# Altium schematic sheet FC-Sch.schdoc
size 576 x 369 mm
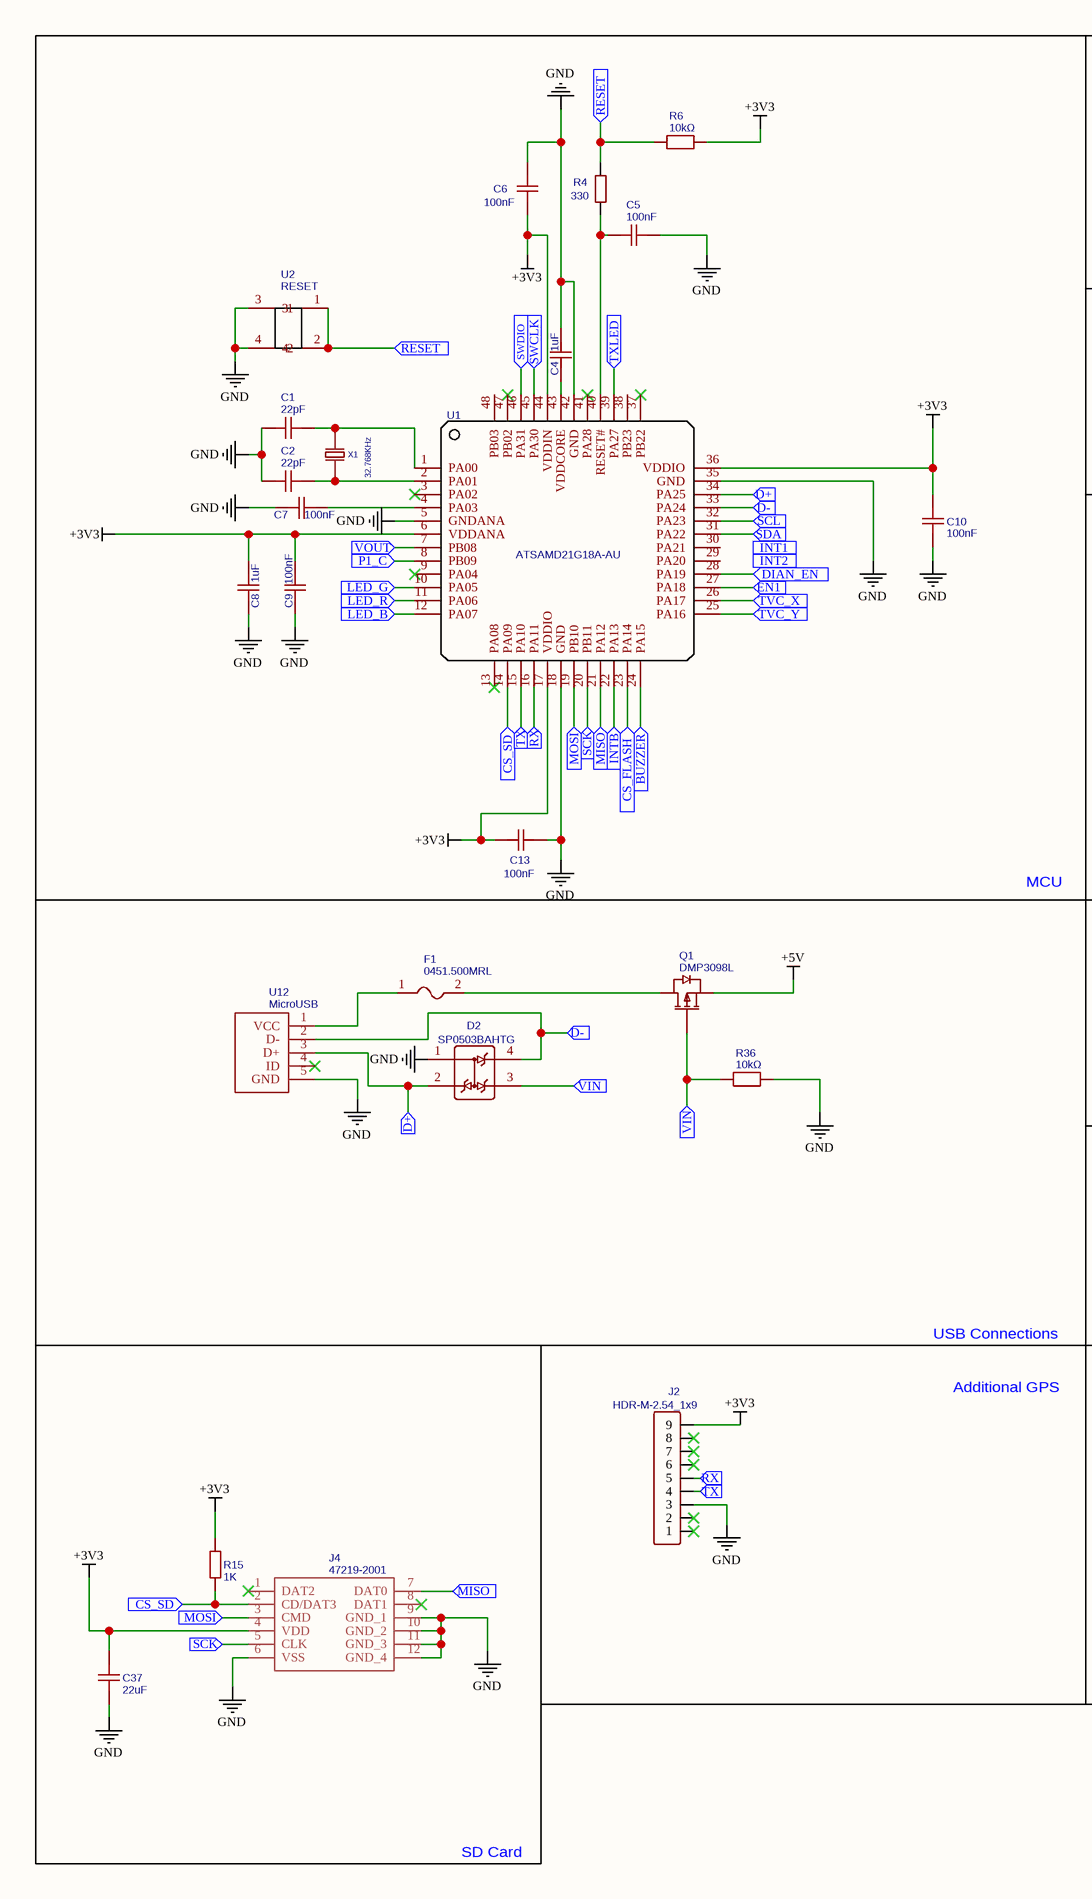
[diagram p0: FC-Sch.schdoc, left]
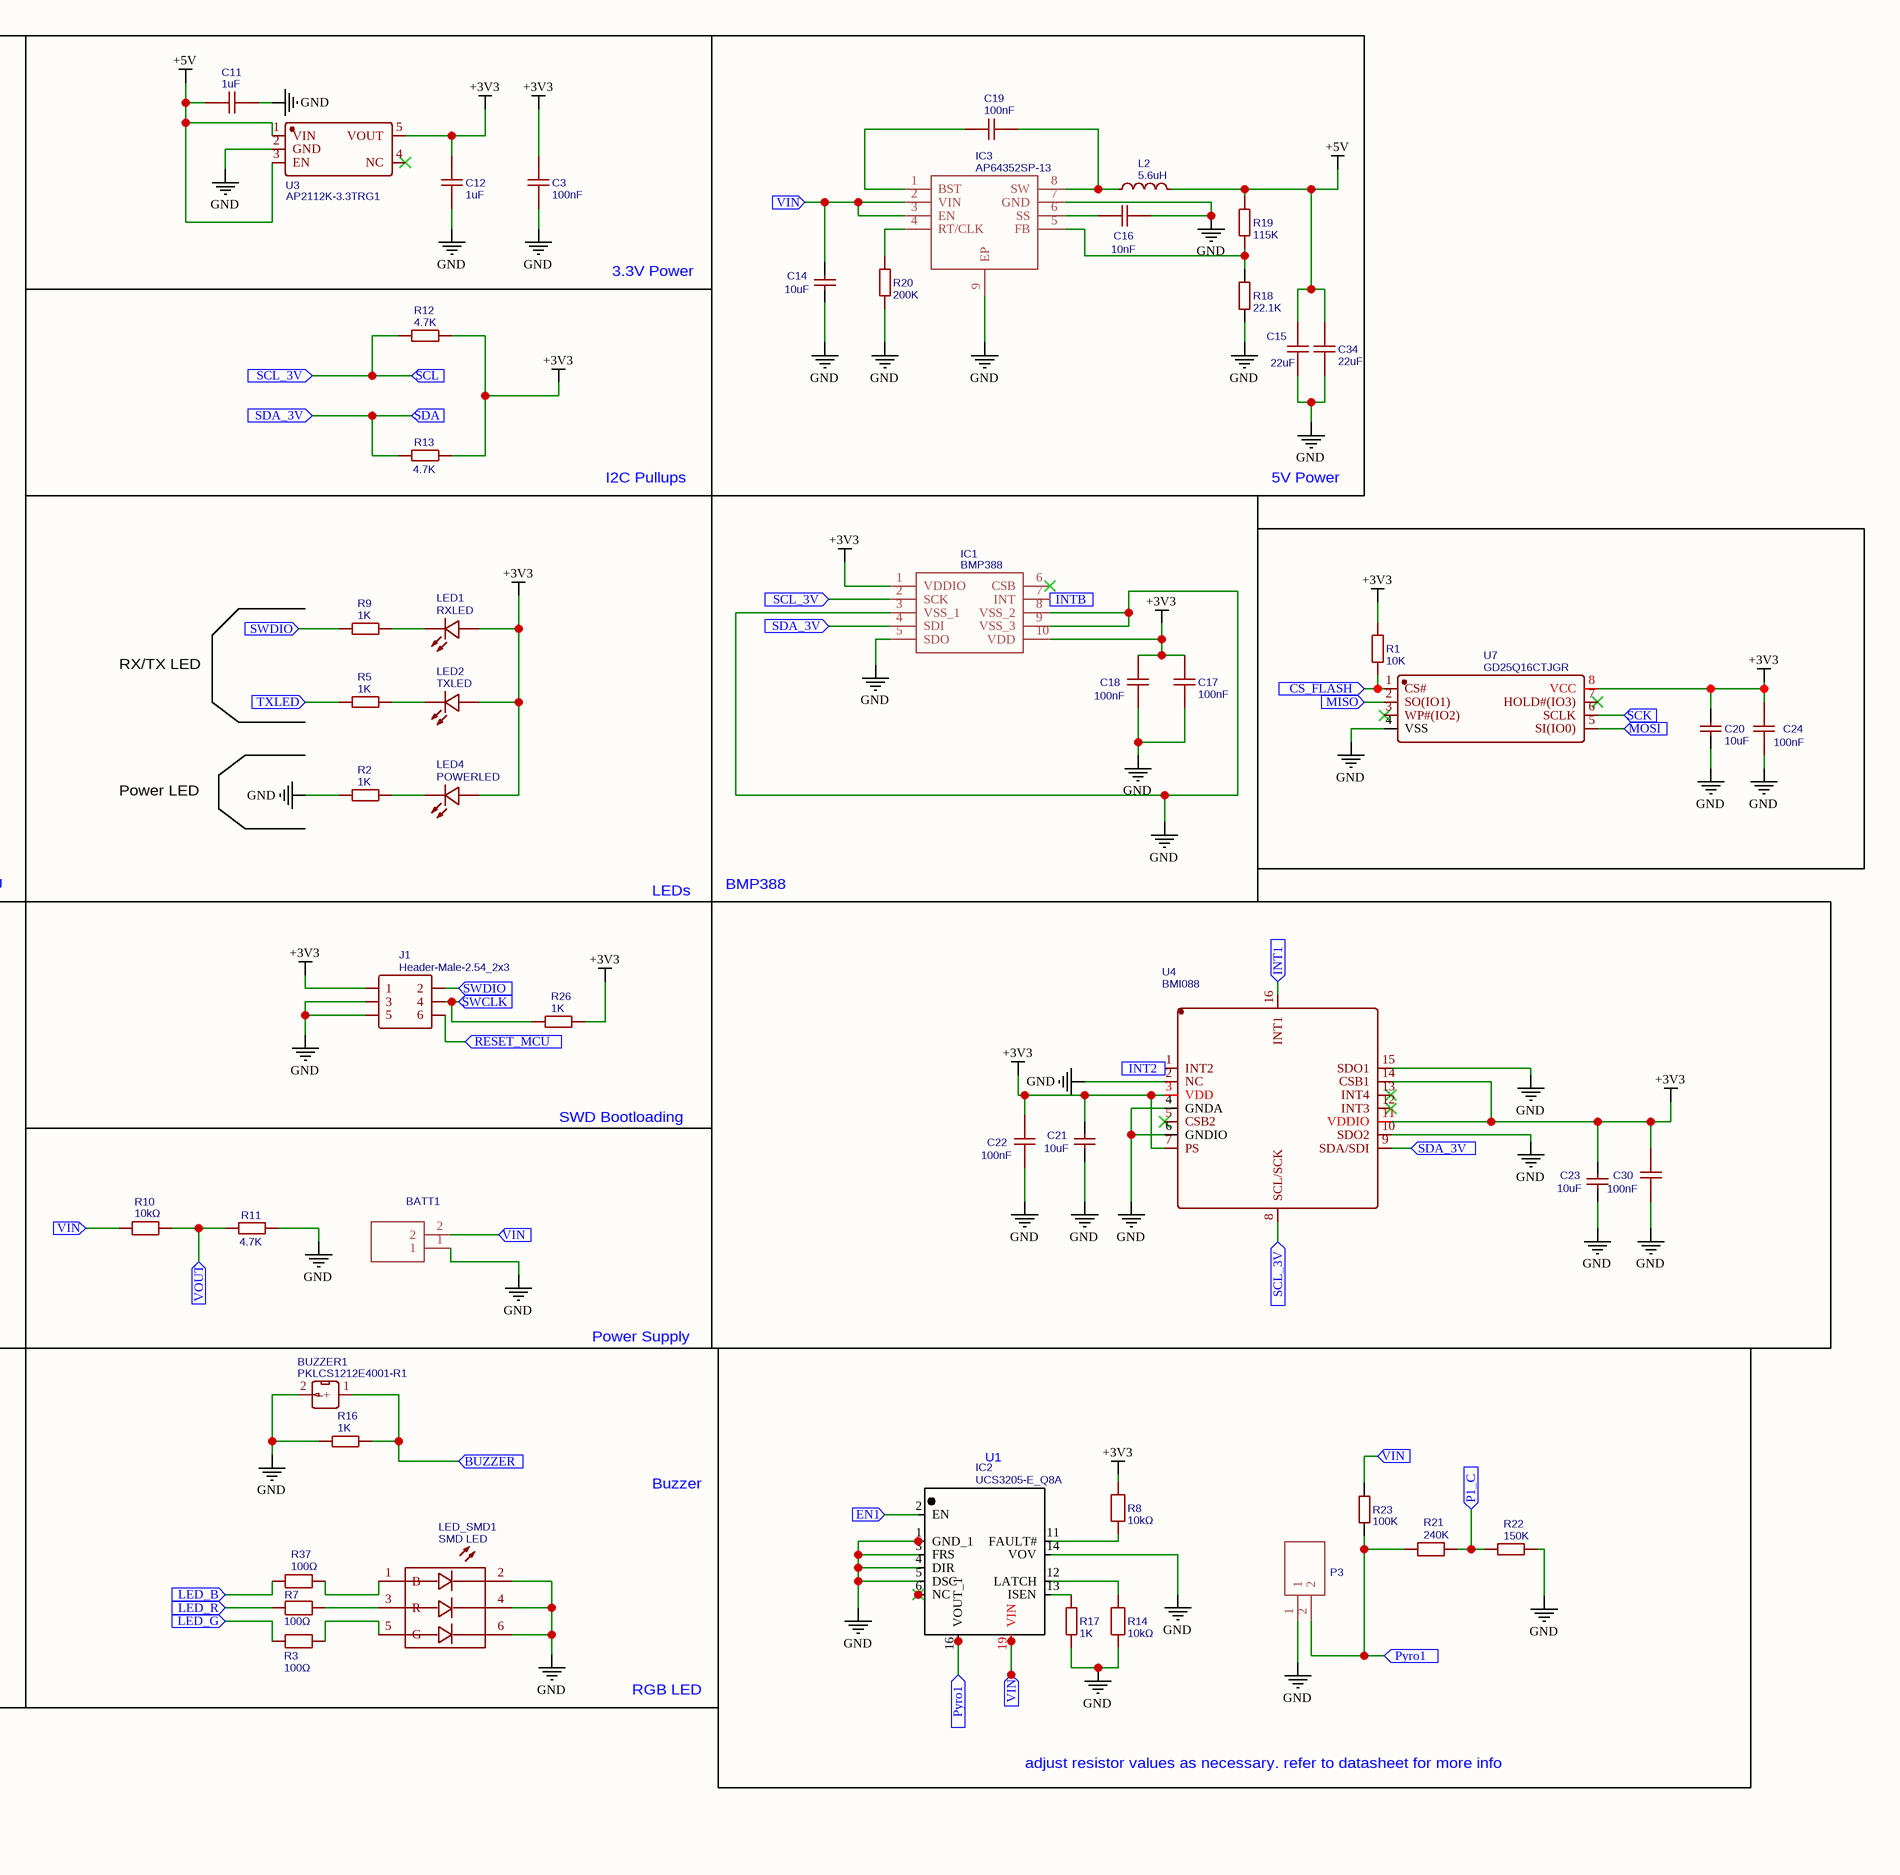
[diagram p1: FC-Sch.schdoc, right]

## Parts
BATT1  1985865  [SHDR2W110P0X508_1X2_1016X810X1]  (value not drawn)
BUZZER1  PKLCS1212E4001-R1  [BUZ-SMD_2P-L12.0-W12.0-L]
C1  22pF  [C0603]
C2  22pF  [C0603]
C3  100nF  [C0603]
C4  1uF  [C0603]
C5  100nF  [C0603]
C6  100nF  [C0603]
C7  100nF  [C0603]
C8  1uF  [C0603]
C9  100nF  [C0603]
C10  100nF  [C0603]
C11  1uF  [C0603]
C12  1uF  [C0603]
C13  100nF  [C0603]
C14  10uF  [C0402]
C15  22uF  [C0805]
C16  10nF  [C0603]
C17  100nF  [C0603]
C18  100nF  [C0603]
C19  100nF  [C0603]
C20  10uF  [C0402]
C21  10uF  [C0402]
C22  100nF  [C0603]
C23  10uF  [C0402]
C24  100nF  [C0402]
C30  100nF  [C0603]
C34  22uF  [C0805]
C37  22uF  [C0805]
D2  SP0503BAHTG  [SOT-143_L2.9-W1.3-P1.92-LS2.3-BR]
F1  0451.500MRL  [FUSE-SMD_L6.1-W2.7]
IC1  BMP388  [BMP388]
IC2  UCS3205-E_Q8A  [UCS3205EQ8A]
IC3  AP64352SP-13  [SOIC127P600X163-9N]
J1  Header-Male-2.54_2x3  [HDR-TH_6P-P2.54-V-R2-C3-S2.54]
J2  HDR-M-2.54_1x9  [HDR-M-2.54_1X9]
J4  47219-2001  [TF-SMD_472192001]
L2  5.6uH  [L0603]
LED1  RXLED  [LED0603-R-RD]
LED2  TXLED  [LED0603-R-RD]
LED4  POWERLED  [LED0603-R-RD]
LED_SMD1  SMD LED  [SMD 5050 RGB]
P3  1985865  [SHDR2W110P0X508_1X2_1016X810X1]  (value not drawn)
Q1  DMP3098L  [SOT-23-3_L2.9-W1.6-P1.90-LS2.8-BR]
R1  10K  [R0402]
R2  1K  [R0603]
R3  100Ω  [R0603]
R4  330  [R0603]
R5  1K  [R0603]
R6  10kΩ  [R0603]
R7  100Ω  [R0603]
R8  10kΩ  [R0603]
R9  1K  [R0603]
R10  10kΩ  [R0603]
R11  4.7K  [R0603]
R12  4.7K  [R0603]
R13  4.7K  [R0603]
R14  10kΩ  [R0603]
R15  1K  [R0603]
R16  1K  [R0603]
R17  1K  [R0603]
R18  22.1K  [R0603]
R19  115K  [R0603]
R20  200K  [R0603]
R21  240K  [R0603]
R22  150K  [R0603]
R23  100K  [R0603]
R26  1K  [R0603]
R36  10kΩ  [R0603]
R37  100Ω  [R0603]
U1  ATSAMD21G18A-AU  [TQFP-48_L7.0-W7.0-P0.50-LS9.0-BL]
U2  RESET  [PUSH BUTTON 6MM TA]
U3  AP2112K-3.3TRG1  [SOT-25-5_L3.0-W1.8-P0.95-LS3.0-BR]
U4  BMI088  [LGA-16_L4.5-W3.0-P0.50-BL]
U7  GD25Q16CTJGR  [SOP-8_L5.3-W5.3-P1.27-LS8.0-BL]
U12  MicroUSB  [MICROUSB]
X1  32.768KHz  [FC-12M_L2.0-W1.2]

## Blocks framed on the sheet
MCU: C1 C2 C4-C10 C13 R4 R6 U1 U2 X1
5V Power: C14-C16 C19 C34 IC3 L2 R18-R20
BMP388: C21-C23 C30 U4
SD Card: C37 J4 R15

## Ports
BUZZER (in), CS_FLASH (in), CS_SD (in), D+ (in), D- (in), DIAN_EN (in), EN1 (in), INT1 (in), INT2 (in), INTB (in), LED_B (in), LED_G (in), LED_R (in), MISO (in), MOSI (in), P1_C (in), Pyro1 (in), RESET (in), RESET_MCU (in), RX (in), SCK (in), SCL (in), SCL_3V (in), SDA (in), SDA_3V (in), SWCLK (in), SWDIO (in), TVC_X (in), TVC_Y (in), TX (in), TXLED (in), VIN (in), VOUT (in)

## Nets
+3V3: C3.2 C6.2 C8.2 C9.1 C10.1 C12.1 C13.1 C17.2 C18.1 C20.2 C21.2 C22.1 C23.2 C24.2 C30.1 C37.2 IC1.1(VDDIO) IC1.10(VDD) J1.1 J2.9 J4.4(VDD) LED1.1(A) LED2.1(A) LED4.1(A) R1.2 R6.1 R8.1 R12.1 R13.2 R15.1 R26.1 U1.6(VDDANA) U1.17(VDDIO) U1.36(VDDIO) U1.44(VDDIN) U3.5(VOUT) U4.3(VDD) U4.7(PS) U4.11(VDDIO) U4.14(CSB1) U7.8(VCC)
+5V: C11.2 C15.2 C34.2 L2.2 Q1.2(S) R19.2 U3.1(VIN) U3.3(EN)
GND: BATT1.1 BUZZER1.2(-) C1.2 C2.2 C3.1 C4.2 C5.1 C6.1 C7.2 C8.1 C9.2 C10.2 C11.1 C12.2 C13.2 C14.1 C15.1 C16.2 C17.1 C18.2 C20.1 C21.1 C22.2 C23.1 C24.1 C30.2 C34.1 C37.1 D2.1 IC1.3(VSS_1) IC1.5(SDO) IC1.8(VSS_2) IC1.9(VSS_3) IC2.1(GND_1) IC2.3(FRS) IC2.4(DIR) IC2.5(DSC) IC2.14(VOV) IC2.15(GND_2) IC3.7(GND) IC3.9(EP) J1.3 J1.5 J2.3 J4.6(VSS) J4.9(GND_1) J4.10(GND_2) J4.11(GND_3) J4.12(GND_4) LED_SMD1.2(B-) LED_SMD1.4(R-) LED_SMD1.6(-g) P3.1 R2.2 R11.2 R14.2 R16.1 R17.2 R18.1 R20.1 R22.2 R36.1 U1.5(GNDANA) U1.18(GND) U1.35(GND) U1.42(GND) U2.3 U2.4 U3.2(GND) U4.2(NC) U4.4(GNDA) U4.6(GNDIO) U4.10(SDO2) U4.15(SDO1) U7.4(VSS) U12.5(GND)
BUZZER: BUZZER1.1(+) R16.2 U1.24(PA15) ; port BUZZER
CS_FLASH: R1.1 U1.23(PA14) U7.1(CS#) ; port CS_FLASH
CS_SD: J4.2(CD/DAT3) R15.2 U1.14(PA09) ; port CS_SD
D+: D2.2 U1.34(PA25) U12.3(D+) ; port D+
D-: D2.4 U1.33(PA24) U12.2(D-) ; port D-
DIAN_EN: U1.28(PA19) ; port DIAN_EN
EN1: IC2.2(EN) U1.27(PA18) ; port EN1
INT1: U4.16(INT1) ; port INT1
INT2: U4.1(INT2) ; port INT2
INTB: IC1.7(INT) U1.22(PA13) ; port INTB
LED_B: R37.1 U1.12(PA07) ; port LED_B
LED_G: R3.1 U1.10(PA05) ; port LED_G
LED_R: R7.1 U1.11(PA06) ; port LED_R
MISO: J4.7(DAT0) U1.21(PA12) U7.2(SO(IO1)) ; port MISO
MOSI: J4.3(CMD) U1.19(PB10) U7.5(SI(IO0)) ; port MOSI
P1_C: R21.2 R22.1 U1.8(PB09) ; port P1_C
Pyro1: IC2.16(VOUT_1) IC2.17(VOUT_2) IC2.22(VOUT_3) P3.2 R21.1 R23.1 ; port Pyro1
RESET: R4.2 R6.2 U2.1 U2.2 ; port RESET
RESET_MCU: J1.6 ; port RESET_MCU
RX: J2.5 U1.16(PA11) ; port RX
SCK: J4.5(CLK) U1.20(PB11) U7.6(SCLK) ; port SCK
SCL: IC1.2(SCK) R12.2 U1.32(PA23) U4.8(SCL/SCK) ; port SCL_3V, port SCL
SDA: IC1.4(SDI) R13.1 U1.31(PA22) U4.9(SDA/SDI) ; port SDA_3V, port SDA
SWCLK: J1.4 R26.2 U1.45(PA30) ; port SWCLK
SWDIO: J1.2 R9.2 U1.46(PA31) ; port SWDIO
TVC_X: U1.26(PA17) ; port TVC_X
TVC_Y: U1.25(PA16) ; port TVC_Y
TX: J2.4 U1.15(PA10) ; port TX
TXLED: R5.2 U1.39(PA27) ; port TXLED
VIN: BATT1.2 C14.2 D2.3 IC2.19(VIN) IC2.20(VIN_2) IC2.21(VIN_3) IC3.2(VIN) IC3.3(EN) Q1.1(G) R10.2 R23.2 R36.2 ; port VIN
VOUT: R10.1 R11.1 U1.7(PB08) ; port VOUT
NetC1_1: C1.1 U1.1(PA00) X1.2
NetC2_1: C2.1 U1.2(PA01) X1.1
NetC4_1: C4.1 U1.43(VDDCORE)
NetC5_2: C5.2 R4.1 U1.40(RESET#)
NetC7_1: C7.1 U1.4(PA03)
NetC16_1: C16.1 IC3.6(SS)
NetC19_1: C19.1 IC3.1(BST)
NetC19_2: C19.2 IC3.8(SW) L2.1
NetF1_1: F1.1 U12.1(VCC)
NetF1_2: F1.2 Q1.3(D)
NetIC2_6: IC2.6(NC) IC2.7(NC_1) IC2.8(NC_1) IC2.9(NC_1) IC2.10(NC_1)
NetIC2_11: IC2.11(FAULT#) R8.2
NetIC2_12: IC2.12(LATCH) R14.1
NetIC2_13: IC2.13(ISEN) R17.1
NetIC3_4: IC3.4(RT/CLK) R20.2
NetIC3_5: IC3.5(FB) R18.2 R19.1
NetLED1_2: LED1.2(K) R9.1
NetLED2_2: LED2.2(K) R5.1
NetLED4_2: LED4.2(K) R2.1
NetLED_SMD1_1: LED_SMD1.1(B) R37.2
NetLED_SMD1_3: LED_SMD1.3(R) R7.2
NetLED_SMD1_5: LED_SMD1.5(G) R3.2

Not connected (* = marked no-connect by the designer): IC1 6(CSB)*; J2 1* 2* 6* 7* 8*; J4 1(DAT2)* 8(DAT1)*; U1 3(PA02)* 9(PA04)* 13(PA08)* 29(PA20) 30(PA21) 37(PB22)* 38(PB23) 41(PA28)* 47(PB02)* 48(PB03); U3 4(NC)*; U4 5(CSB2)* 12(INT3)* 13(INT4)*; U7 3(WP#(IO2))* 7(HOLD#(IO3))*; U12 4(ID)*

## Notes on the sheet
- 3.3V Power
- I2C Pullups
- RX/TX LED
- Power LED
- LEDs
- SWD Bootloading
- USB Connections
- Power Supply
- Additional GPS
- Buzzer
- RGB LED
- adjust resistor values as necessary. refer to datasheet for more info
- (in symbol UCS3205-E_Q8A) U1

## Library data of the parts
BATT1 P3 = 1985865: Contributor: jgroezin; spicePre: J; spiceSymbolName: 1985865
BUZZER1 = PKLCS1212E4001-R1: BOM_Manufacturer: Murata Electronics; Contributor: LCSC; BOM_Supplier: LCSC; BOM_Supplier Part: C113159; BOM_Manufacturer Part: PKLCS1212E4001-R1; BOM_JLCPCB Part Class: Extended Part; spicePre: B; spiceSymbolName: PKLCS1212E4001-R1
C1 C2 = 22pF: BOM_Manufacturer: Huaxin S&T; BOM_Manufacturer Part: 0603N220J500CT; nameAlias: Capacitance; Contributor: LCSC; BOM_Supplier: LCSC; BOM_Supplier Part: C302059; spicePre: C; spiceSymbolName: 0603N220J500CT
C3 C5-C7 C9 C10 C13 C17-C19 C22 C30 = 100nF: BOM_Manufacturer: MuRata; BOM_Manufacturer Part: GRM188F51E104ZA01D; nameAlias: Capacitance; BOM_Supplier: LCSC; BOM_Supplier Part: C86002; spicePre: C; spiceSymbolName: GRM188F51E104ZA01D
C4 = 1uF: BOM_Manufacturer: MuRata; BOM_Manufacturer Part: GCM188R71E105KA64D; nameAlias: Capacitance; BOM_Supplier: LCSC; BOM_Supplier Part: C85862; BOM_JLCPCB Part Class: Extended Part; spicePre: C; spiceSymbolName: GCM188R71E105KA64D
C8 C11 C12 = 1uF: BOM_Manufacturer: Samsung Electro-Mechanics; BOM_Manufacturer Part: 10uF; nameAlias: Value; Contributor: LCSC; BOM_Supplier: LCSC; BOM_Supplier Part: C15415; BOM_JLCPCB Part Class: Extended Part; spicePre: C; spiceSymbolName: 10UF
C14 C20 C21 C23 = 10uF: BOM_Manufacturer Part: CL05A106MQ5NUNC; BOM_Manufacturer: SAMSUNG; nameAlias: Capacitance; BOM_Supplier: LCSC; BOM_Supplier Part: C15525; BOM_JLCPCB Part Class: Basic Part; spicePre: C; spiceSymbolName: CL05A106MQ5NUNC
C15 C34 C37 = 22uF: BOM_Manufacturer: SAMSUNG; BOM_Manufacturer Part: CL21A226MQQNNNE; nameAlias: Capacitance; BOM_Supplier: LCSC; BOM_Supplier Part: C5674; BOM_JLCPCB Part Class: Extended Part; spicePre: C; spiceSymbolName: CL21A226MQQNNNE
C16 = 10nF: BOM_Manufacturer: MuRata; BOM_Manufacturer Part: GRM188R11H103KA01D; nameAlias: Capacitance; BOM_Supplier: LCSC; BOM_Supplier Part: C86008; spicePre: C; spiceSymbolName: GRM188R11H103KA01D
C24 = 100nF: BOM_Manufacturer: MuRata; BOM_Manufacturer Part: GRM155R71H104KE14D; nameAlias: Capacitance; BOM_Supplier: LCSC; BOM_Supplier Part: C77020; BOM_JLCPCB Part Class: Extended Part; spicePre: C; spiceSymbolName: GRM155R71H104KE14D
D2 = SP0503BAHTG: BOM_Manufacturer: Littelfuse; BOM_Supplier: LCSC; BOM_Manufacturer Part: SP0503BAHTG; BOM_Supplier Part: C7074; BOM_JLCPCB Part Class: Extended Part; spicePre: D; spiceSymbolName: SP0503BAHTG
F1 = 0451.500MRL: BOM_Manufacturer: Littelfuse; Contributor: LCSC; BOM_Supplier: LCSC; BOM_Supplier Part: C142836; BOM_Manufacturer Part: 0451.500MRL; BOM_JLCPCB Part Class: Extended Part; spicePre: F; spiceSymbolName: 0451.500MRL
IC1 = BMP388: Contributor: LFK84; spicePre: I; spiceSymbolName: BMP388
IC2 = UCS3205-E_Q8A: Contributor: New Mexico Rocketry Reviews; spicePre: I; spiceSymbolName: UCS3205-E_Q8A
IC3 = AP64352SP-13: Contributor: Darwin Sabanovic; spicePre: I; spiceSymbolName: AP64352SP-13
J1 = Header-Male-2.54_2x3: BOM_Manufacturer: BOOMELE; BOM_Supplier: LCSC; BOM_Manufacturer Part: Header-Male-2.54_2x3; BOM_Supplier Part: C65114; BOM_JLCPCB Part Class: Extended Part; spicePre: J; spiceSymbolName: Header-Male-2.54_2x3
J2 = HDR-M-2.54_1x9: Contributor: LCEDA_Lib; BOM_Supplier Part: C225484; BOM_Supplier: LCSC; spicePre: J; spiceSymbolName: HDR-M-2.54_1x9
L2 = 5.6uH: BOM_Manufacturer: CEC; BOM_Manufacturer Part: CI1608C5R6K; nameAlias: Inductance; BOM_Supplier: LCSC; BOM_Supplier Part: C107513; BOM_JLCPCB Part Class: Extended Part; spicePre: L; spiceSymbolName: CI1608C5R6K
LED1 = RXLED: BOM_Manufacturer: KENTO; BOM_Manufacturer Part: KT-0603R; BOM_Supplier: LCSC; BOM_Supplier Part: C2286; BOM_JLCPCB Part Class: Basic Part; spicePre: L; spiceSymbolName: KT-0603R
LED2 = TXLED: BOM_Manufacturer: KENTO; BOM_Manufacturer Part: KT-0603R; BOM_Supplier: LCSC; BOM_Supplier Part: C2286; BOM_JLCPCB Part Class: Basic Part; spicePre: L; spiceSymbolName: KT-0603R
LED4 = POWERLED: BOM_Manufacturer: KENTO; BOM_Manufacturer Part: KT-0603R; BOM_Supplier: LCSC; BOM_Supplier Part: C2286; BOM_JLCPCB Part Class: Basic Part; spicePre: L; spiceSymbolName: KT-0603R
LED_SMD1 = SMD LED: Contributor: Se_Vi; BOM_Manufacturer Part: SMD 5050 RGB; spicePre: L; spiceSymbolName: SMD 5050 RGB (B-R-G)
Q1 = DMP3098L: BOM_Manufacturer: SK; BOM_Supplier: LCSC; BOM_Manufacturer Part: DMP3098L; BOM_Supplier Part: C130884; BOM_JLCPCB Part Class: Extended Part; spicePre: Q; spiceSymbolName: DMP3098L
R1 = 10K: BOM_Manufacturer: Hong Kong Resistors; BOM_Manufacturer Part: RCT0210KJLF; nameAlias: Resistance (Ohms); Contributor: LCSC; BOM_Supplier: LCSC; BOM_Supplier Part: C174175; BOM_JLCPCB Part Class: Extended Part; spicePre: R; spiceSymbolName: RCT0210KJLF
R2 R5 R9 R15-R17 R26 = 1K: BOM_Manufacturer: ROHM Semicon; BOM_Manufacturer Part: MCR03EZPFX1001; nameAlias: Resistance (Ohms); Contributor: LCSC; BOM_Supplier: LCSC; BOM_Supplier Part: C253378; spicePre: R; spiceSymbolName: MCR03EZPFX1001
R3 R7 R37 = 100Ω: BOM_Manufacturer: Viking Tech; BOM_Manufacturer Part: AR03FTC1000; nameAlias: Resistance (Ohms); Contributor: LCSC; BOM_Supplier: LCSC; BOM_Supplier Part: C234233; BOM_JLCPCB Part Class: Extended Part; spicePre: R; spiceSymbolName: AR03FTC1000
R4 = 330: BOM_Manufacturer Part: 330R 5% 0603; BOM_Manufacturer: FH; nameAlias: Resistance (Ohms); BOM_Supplier: LCSC; BOM_Supplier Part: C22104; spicePre: R; spiceSymbolName: 330R 5% 0603
R6 R8 R10 R14 R36 = 10kΩ: BOM_Manufacturer: UNI-ROYAL(Uniroyal Elec); BOM_Manufacturer Part: TC0310F1002T5H; nameAlias: Resistance (Ohms); Contributor: LCSC; BOM_Supplier: LCSC; BOM_Supplier Part: C516825; BOM_JLCPCB Part Class: Extended Part; spicePre: R; spiceSymbolName: TC0310F1002T5H
R11-R13 = 4.7K: BOM_Manufacturer: Huaxin S&T; BOM_Manufacturer Part: WR06X472JTL; nameAlias: Resistance (Ohms); Contributor: LCSC; BOM_Supplier: LCSC; BOM_Supplier Part: C163915; BOM_JLCPCB Part Class: Extended Part; spicePre: R; spiceSymbolName: WR06X472JTL_C163915
R18 = 22.1K: BOM_Manufacturer: UniOhm; BOM_Manufacturer Part: TC0325B2212T5E; nameAlias: Resistance (Ohms); Contributor: LCSC; BOM_Supplier: LCSC; BOM_Supplier Part: C139124; BOM_JLCPCB Part Class: Extended Part; spicePre: R; spiceSymbolName: TC0325B2212T5E
R19 = 115K: BOM_Manufacturer: BOURNS; BOM_Manufacturer Part: CR0603-FX-1153ELF; nameAlias: Resistance (Ohms); Contributor: LCSC; BOM_Supplier: LCSC; BOM_Supplier Part: C203254; BOM_JLCPCB Part Class: Extended Part; spicePre: R; spiceSymbolName: CR0603-FX-1153ELF
R20 = 200K: BOM_Manufacturer: YAGEO; BOM_Manufacturer Part: AC0603JR-07200KL; nameAlias: Resistance (Ohms); Contributor: LCSC; BOM_Paste Type: Extended Part; BOM_Supplier: LCSC; BOM_Supplier Part: C228158; BOM_JLCPCB Part Class: Extended Part; spicePre: R; spiceSymbolName: AC0603JR-07200KL
R21 = 240K: BOM_Manufacturer: Uniroyal Elec; BOM_Manufacturer Part: 0603WAD2403T5E; nameAlias: Resistance (Ohms); Contributor: LCSC; BOM_Supplier: LCSC; BOM_Supplier Part: C407611; spicePre: R; spiceSymbolName: 0603WAD2403T5E
R22 = 150K: BOM_Manufacturer: Ever Ohms Tech; BOM_Manufacturer Part: TR0603B150KP0525; nameAlias: Resistance (Ohms); Contributor: LCSC; BOM_Supplier: LCSC; BOM_Supplier Part: C149923; BOM_JLCPCB Part Class: Extended Part; spicePre: R; spiceSymbolName: TR0603B150KP0525
R23 = 100K: BOM_Manufacturer: SUSUMU; BOM_Manufacturer Part: RG1608P-104-B-T5; nameAlias: Resistance (Ohms); Contributor: LCSC; BOM_Supplier: LCSC; BOM_Supplier Part: C328672; BOM_JLCPCB Part Class: Extended Part; spicePre: R; spiceSymbolName: RG1608P-104-B-T5
U1 = ATSAMD21G18A-AU: BOM_Manufacturer: MICROCHIP; Contributor: LCSC; BOM_Supplier: LCSC; BOM_Manufacturer Part: ATSAMD21G18A-AU; BOM_Supplier Part: C78624; BOM_JLCPCB Part Class: Extended Part; spicePre: U; spiceSymbolName: ATSAMD21G18A-AU
U2 = RESET: BOM_Manufacturer Part: Pushbutton; Contributor: rone alves; spicePre: U; spiceSymbolName: Pushbutton_copy
U3 = AP2112K-3.3TRG1: BOM_Manufacturer: DIODES; Contributor: LCSC; BOM_Supplier: LCSC; BOM_Manufacturer Part: AP2112K-3.3TRG1; BOM_Supplier Part: C51118; BOM_JLCPCB Part Class: Extended Part; spicePre: U; spiceSymbolName: AP2112K-3.3TRG1
U4 = BMI088: BOM_Manufacturer: Bosch Sensortec; Contributor: LCSC; BOM_Supplier: LCSC; BOM_Supplier Part: C194919; BOM_Manufacturer Part: BMI088; BOM_JLCPCB Part Class: Extended Part; spicePre: U; spiceSymbolName: BMI088
U7 = GD25Q16CTJGR: BOM_Manufacturer: GigaDevice Semicon Beijing; Contributor: LCSC; BOM_Supplier: LCSC; BOM_Supplier Part: C395530; BOM_Manufacturer Part: GD25Q16CTJGR; BOM_JLCPCB Part Class: Extended Part; spicePre: U; spiceSymbolName: GD25Q16CTJGR
U12 = MicroUSB: description: Molex Micro USB 105017-0001; Contributor: SparkFun; sourceId: qPJDVoYkG; timeStamp: 1463643012; spicePre: U; spiceSymbolName: MicroUSB
X1 = 32.768KHz: BOM_Manufacturer Part: X1A000061000200; BOM_Manufacturer: EPSON; nameAlias: Frequency; BOM_Supplier: LCSC; BOM_Supplier Part: C55208; BOM_JLCPCB Part Class: Extended Part; spicePre: X; spiceSymbolName: X1A000061000200
J4 = 47219-2001: spicePre: J; spiceSymbolName: 47219-2001